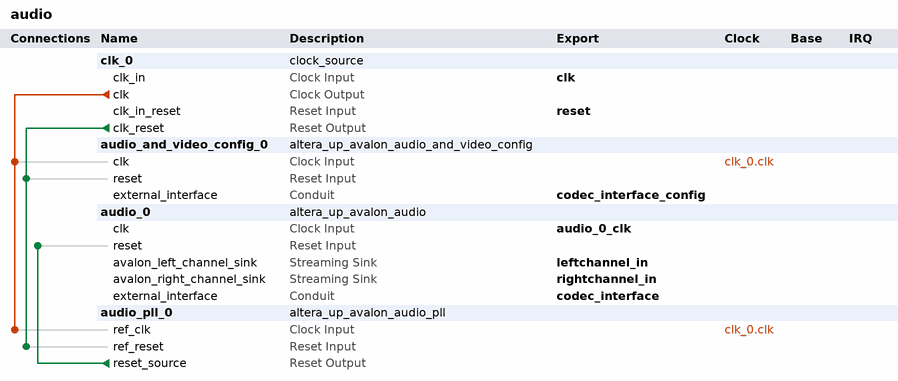
[diagram p0: system contents]
# Platform Designer (Qsys) system audio, Cyclone IV E EP4CE115F29C7
# Parameters at their usual value, and those the tool derives, are not listed.
package require -exact qsys 15.1
create_system audio
set_project_property DEVICE_FAMILY {Cyclone IV E}
set_project_property DEVICE EP4CE115F29C7

add_instance clk_0 clock_source 16.0
set_instance_parameter_value clk_0 clockFrequency 50000000

add_instance audio_and_video_config_0 altera_up_avalon_audio_and_video_config 15.1
set_instance_parameter_value audio_and_video_config_0 audio_in {Microphone to ADC}
set_instance_parameter_value audio_and_video_config_0 bit_length 16
set_instance_parameter_value audio_and_video_config_0 board DE2-115
set_instance_parameter_value audio_and_video_config_0 line_in_bypass false
set_instance_parameter_value audio_and_video_config_0 sampling_rate {48 kHz}

add_instance audio_0 altera_up_avalon_audio 15.1
set_instance_parameter_value audio_0 audio_in false
set_instance_parameter_value audio_0 avalon_bus_type Streaming
set_instance_parameter_value audio_0 dw 16

add_instance audio_pll_0 altera_up_avalon_audio_pll 15.1
set_instance_parameter_value audio_pll_0 audio_clk_freq 18.432
set_instance_parameter_value audio_pll_0 gui_refclk 50.0

# connections
add_connection clk_0.clk audio_and_video_config_0.clk clock
add_connection clk_0.clk audio_pll_0.ref_clk clock
add_connection audio_pll_0.reset_source audio_0.reset reset
add_connection clk_0.clk_reset audio_and_video_config_0.reset reset
add_connection clk_0.clk_reset audio_pll_0.ref_reset reset

# exported interfaces
add_interface audio_0_clk clock sink
set_interface_property audio_0_clk EXPORT_OF audio_0.clk
add_interface clk clock sink
set_interface_property clk EXPORT_OF clk_0.clk_in
add_interface codec_interface conduit end
set_interface_property codec_interface EXPORT_OF audio_0.external_interface
add_interface codec_interface_config conduit end
set_interface_property codec_interface_config EXPORT_OF audio_and_video_config_0.external_interface
add_interface leftchannel_in avalon_streaming sink
set_interface_property leftchannel_in EXPORT_OF audio_0.avalon_left_channel_sink
add_interface reset reset sink
set_interface_property reset EXPORT_OF clk_0.clk_in_reset
add_interface rightchannel_in avalon_streaming sink
set_interface_property rightchannel_in EXPORT_OF audio_0.avalon_right_channel_sink

set_interconnect_requirement {$system} qsys_mm.clockCrossingAdapter HANDSHAKE
set_interconnect_requirement {$system} qsys_mm.enableEccProtection FALSE
set_interconnect_requirement {$system} qsys_mm.insertDefaultSlave FALSE
set_interconnect_requirement {$system} qsys_mm.maxAdditionalLatency 1

save_system audio.qsys
